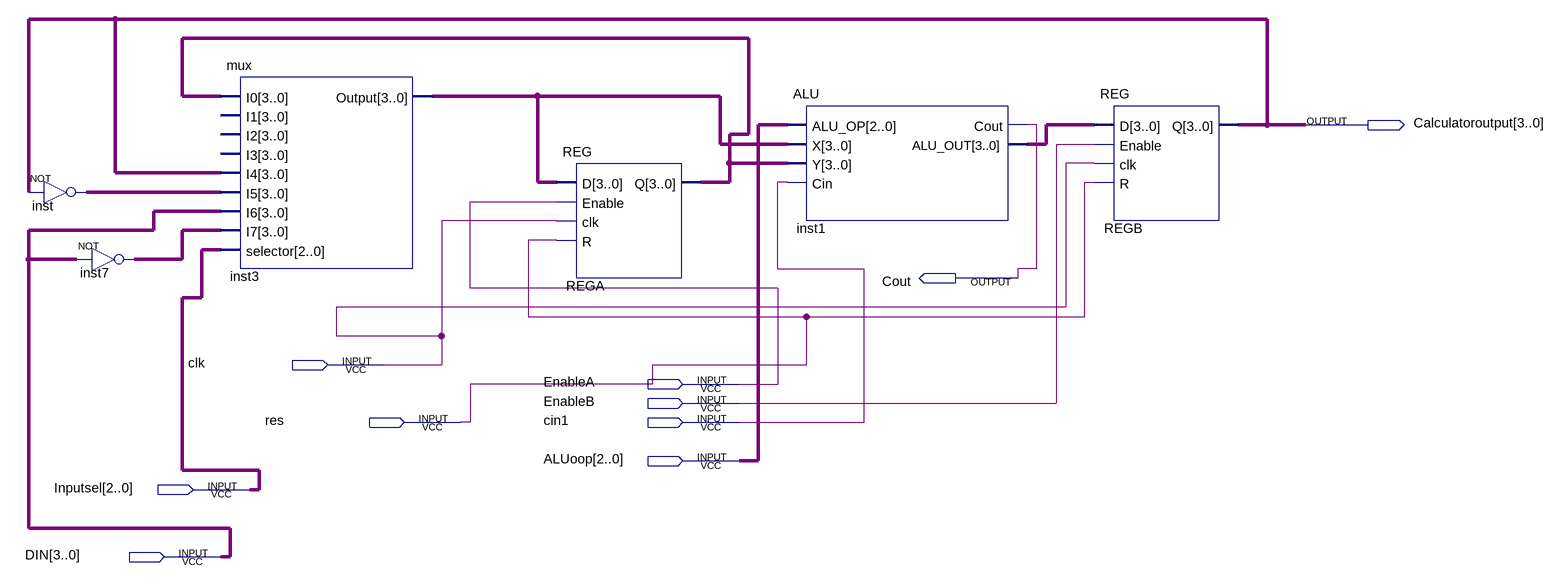
[diagram p0: schematic sheet]
// Quartus schematic datapath.bdf as structural Verilog: 6 symbols, 10 pins
module datapath (
  input  clk,
  input  EnableA,
  input  EnableB,
  input  res,
  input  cin1,
  input  [2:0] ALUoop,
  input  [2:0] Inputsel,
  input  [3:0] DIN,
  output [3:0] Calculatoroutput,
  output Cout
);

  wire [3:0] inst1_alu_out, inst3_output, inst7_out, inst_out, REGA_q;

  assign inst_out = ~Calculatoroutput;  // NOT inst, 4 bits wide
  assign inst7_out = ~DIN;  // NOT inst7, 4 bits wide
  mux inst3 (
    .I0(REGA_q), .I4(Calculatoroutput), .I5(inst_out), .I6(DIN), .I7(inst7_out), .selector(Inputsel),
    .Output(inst3_output));  // open: I1, I2, I3
  REG REGA (.D(inst3_output), .Enable(EnableA), .clk(clk), .R(res), .Q(REGA_q));
  ALU inst1 (.ALU_OP(ALUoop), .X(inst3_output), .Y(REGA_q), .Cin(cin1), .Cout(Cout), .ALU_OUT(inst1_alu_out));
  REG REGB (.D(inst1_alu_out), .Enable(EnableB), .clk(clk), .R(res), .Q(Calculatoroutput));
endmodule
